# Altium project DC_Motor_Drive.PrjPcb
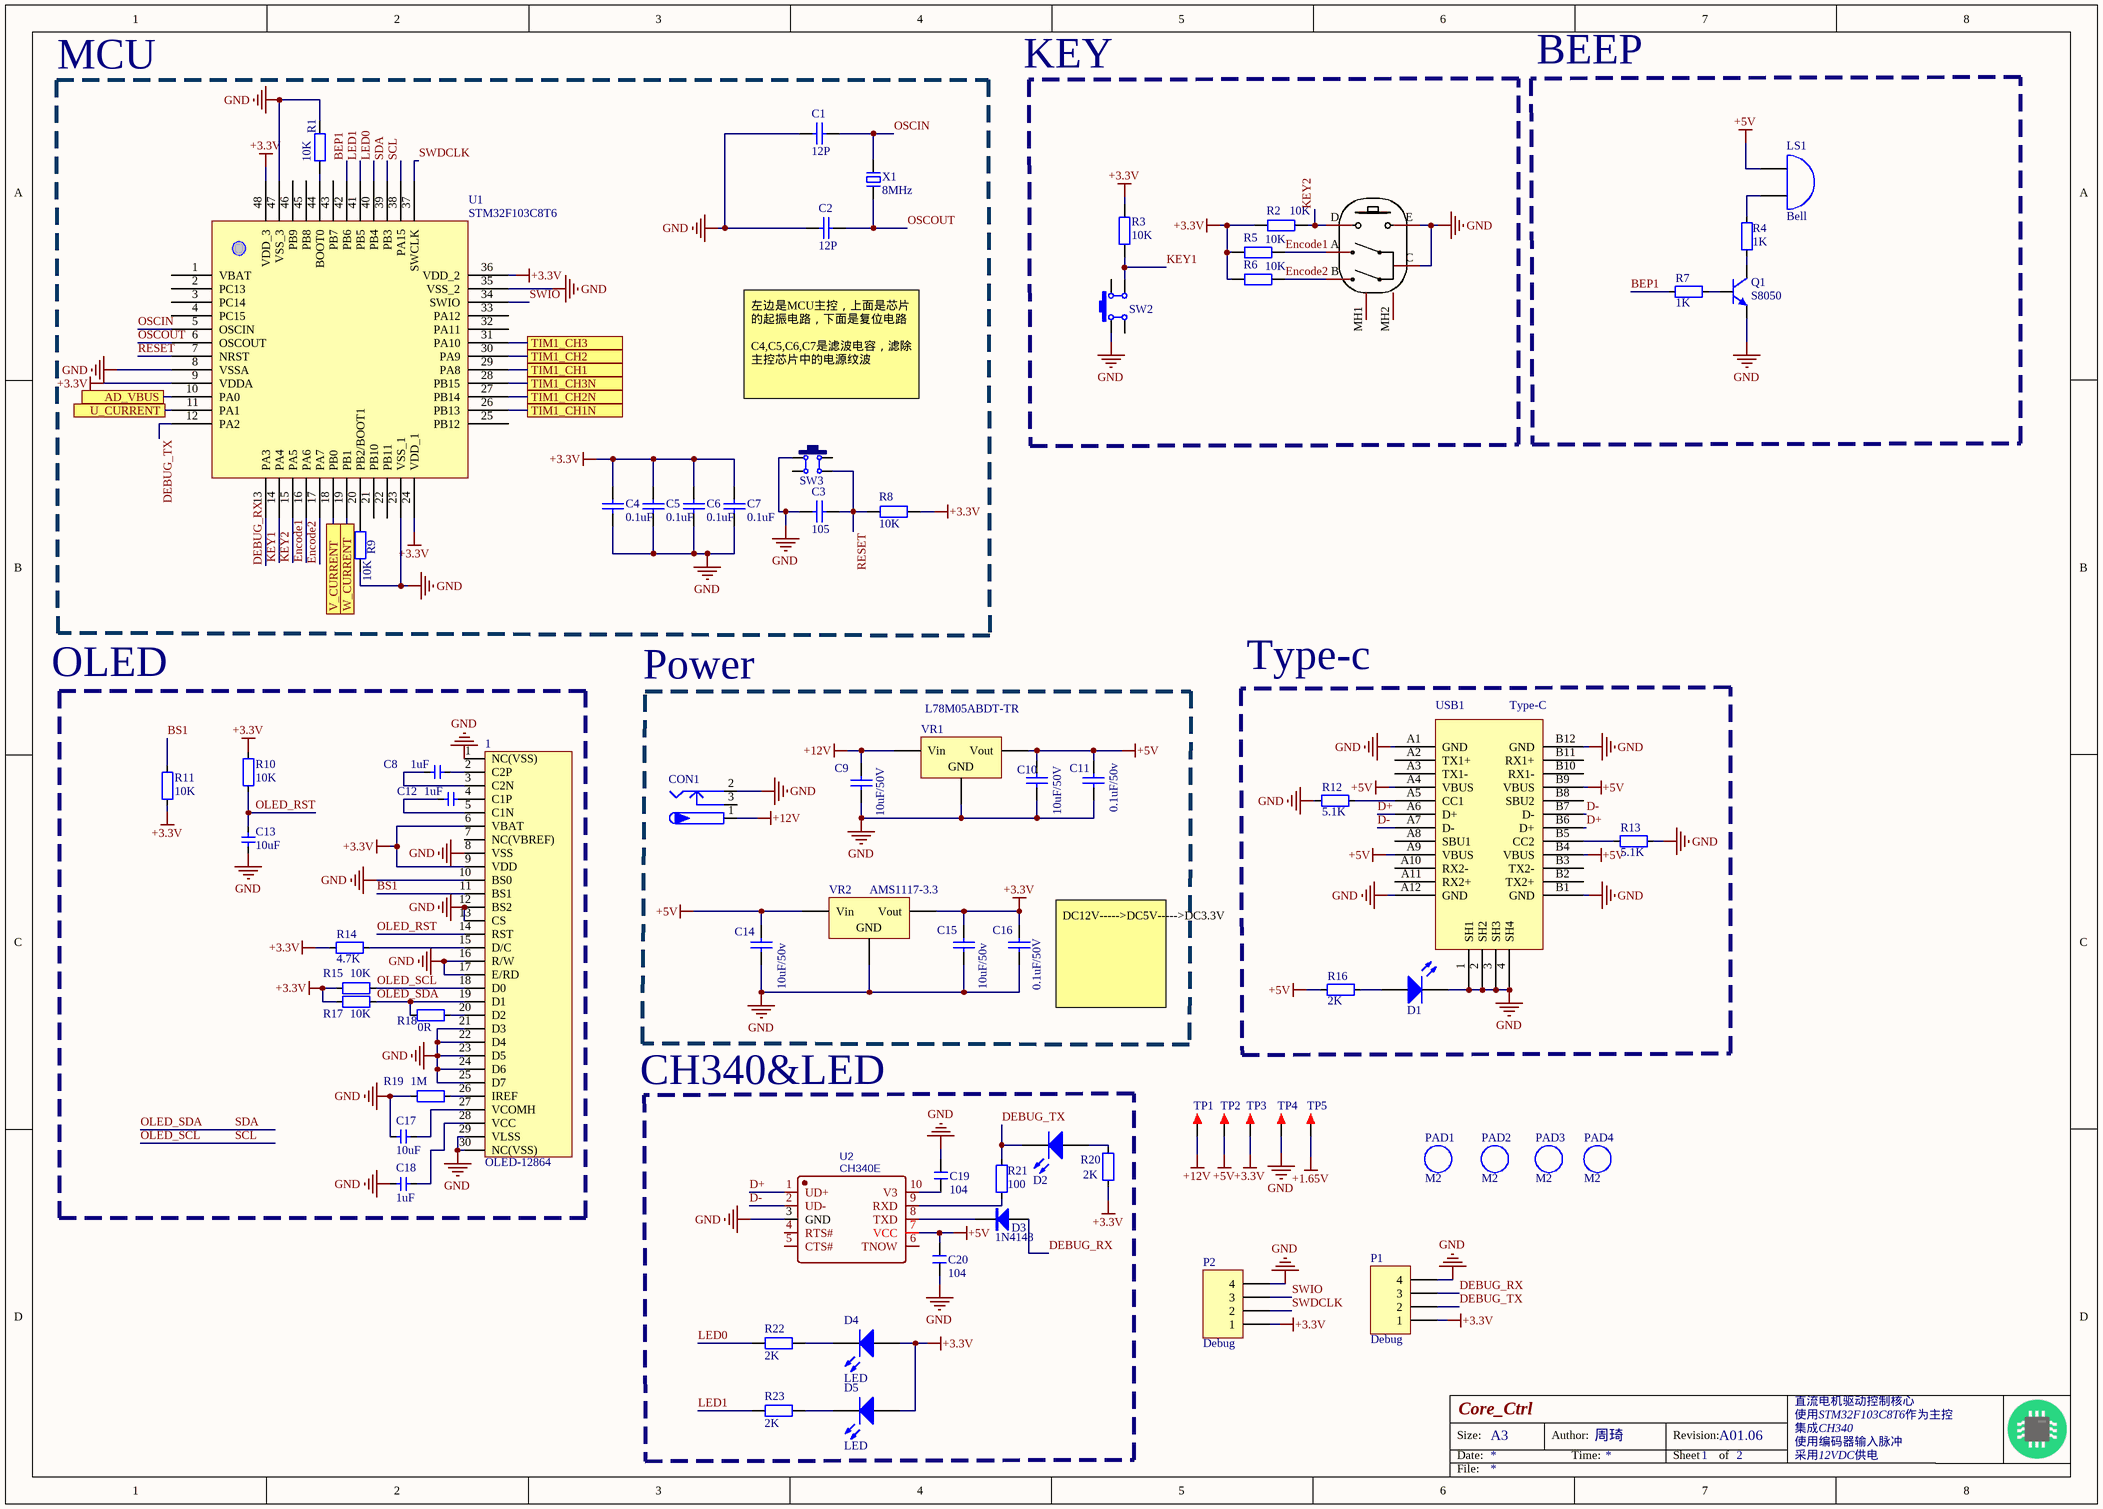
[diagram p0: Main.SchDoc]
2 sheets, 169 parts. Net scope: flat (ports and power ports of the same name join across sheets).
Board file: DC_Motor.PcbDoc
Sheets:
  Main.SchDoc
  BLDC.SchDoc

## Sheet Main.SchDoc: Core_Ctrl
size A3; Author: 周琦; Organization: 直流电机驱动控制核心; Address1: 使用STM32F103C8T6作为主控; Address2: 集成CH340; Address3: 使用编码器输入脉冲; Address4: 采用12VDC供电; Revision: A01.06; SheetNumber: 1; SheetTotal: 2

### Parts
1  OLED-12864  [OLED-12864-1.3-TOP]
C1  12P  [C0603_L]
C2  12P  [C0603_L]
C3  105  [C0603_L]
C4  0.1uF  [C0603_L]
C5  0.1uF  [C0603_L]
C6  0.1uF  [C0603_L]
C7  0.1uF  [C0603_L]
C8  1uF  [C0603_L]
C9  10uF/50V  [C1206_L]
C10  10uF/50V  [C1206_L]
C11  0.1uF/50v  [C1206_L]
C12  1uF  [C0603_L]
C13  10uF  [C0603_L]
C14  10uF/50v  [C1206_L]
C15  10uF/50v  [C1206_L]
C16  0.1uF/50V  [C0603_L]
C17  10uF  [C0603_L]
C18  1uF  [C0603_L]
C19  104  [C0603_L]
C20  104  [C0603_L]
CON1  3.5*1.3  [DC-005]  (value not drawn)
D1  LED0  [LED0603_R]  (value not drawn)
D2  LED0  [LED0603_G]  (value not drawn)
D3  1N4148  [SOD-123]
D4  LED  [LED0603_B]
D5  LED  [LED0603_B]
LS1  Bell  [BEEP 5x9x5.5]
P1  Debug  [HDR2.54-LI-4P]
P2  Debug  [HDR2.54-LI-4P]
PAD1  M2  [M2]
PAD2  M2  [M2]
PAD3  M2  [M2]
PAD4  M2  [M2]
Q1  S8050  [SOT23-3N]
R1  10K  [R0603_L]
R2  10K  [R0603_L]
R3  10K  [R0603_L]
R4  1K  [R0603_L]
R5  10K  [R0603_L]
R6  10K  [R0603_L]
R7  1K  [R0603_L]
R8  10K  [R0603_L]
R9  10K  [R0603_L]
R10  10K  [R0603_L]
R11  10K  [R0603_L]
R12  5.1K  [R0603_L]
R13  5.1K  [R0603_L]
R14  4.7K  [R0603_L]
R15  10K  [R0603_L]
R16  2K  [R0603_L]
R17  10K  [R0603_L]
R18  0R  [R0603_L]
R19  1M  [R0603_L]
R20  2K  [R0603_L]
R21  100  [R0603_L]
R22  2K  [R0603_L]
R23  2K  [R0603_L]
SW1  EC11K1524406  [SW-TH_EC11K1524406]  (value not drawn)
SW2  12x12x5  [SW DIP-12*12*4.3]  (value not drawn)
SW3  6x6x5  [SW SMD-6*6*5]  (value not drawn)
TP1  TEST  [TEST 1.6]  (value not drawn)
TP2  TEST  [TEST 1.6]  (value not drawn)
TP3  TEST  [TEST 1.6]  (value not drawn)
TP4  TEST  [TEST 1.6]  (value not drawn)
TP5  TEST  [TEST 1.6]  (value not drawn)
U1  STM32F103C8T6  [LQFP48-7*7]
U2  CH340E  [MSOP10_M]
USB1  Type-C  [USB-C-SMD_16P]
VR1  L78M05ABDT-TR  [TO-252]
VR2  AMS1117-3.3  [SOT223_L]
X1  8MHz  [OSC HC-49SMD]

### Blocks framed on the sheet
MCU: C1-C7 R1 R8 R9 SW3 U1 X1
BEEP: LS1 Q1 R4 R7
Power: C9-C11 C14-C16 CON1 VR1 VR2
Type-c: D1 R12 R13 R16 USB1

### Ports
AD_VBUS, TIM1_CH1, TIM1_CH1N, TIM1_CH2, TIM1_CH2N, TIM1_CH3, TIM1_CH3N, U_CURRENT, V_CURRENT, W_CURRENT

### Nets
+1.65V: TP5.1
+3.3V: 1.6(VBAT) 1.9(VDD) C4.1 C5.1 C6.1 C7.1 C15.2 C16.2 D4.1(A) D5.1(A) P1.1 P2.1 R2.2 R3.2 R5.2 R6.2 R8.2 R10.2 R11.1 R14.2 R15.1 R17.1 R20.1 TP3.1 U1.9(VDDA) U1.24(VDD_1) U1.36(VDD_2) U1.48(VDD_3) VR2.2(Vout)
+5V: C10.2 C11.2 C14.2 C20.1 LS1.1(A) R16.1 TP2.1 U2.7(VCC) USB1.A4(VBUS) USB1.A9(VBUS) USB1.B4(VBUS) USB1.B9(VBUS) VR1.3(Vout) VR2.3(Vin)
+12V: C9.2 CON1.1 TP1.1 VR1.1(Vin)
GND: 1.1(NC(VSS)) 1.8(VSS) 1.10(BS0) 1.12(BS2) 1.13(CS) 1.16(R/W) 1.17(E/RD) 1.21(D3) 1.22(D4) 1.23(D5) 1.24(D6) 1.25(D7) 1.29(VLSS) 1.30(NC(VSS)) C1.1 C2.1 C3.1 C4.2 C5.2 C6.2 C7.2 C9.1 C10.1 C11.1 C13.1 C14.1 C15.1 C16.1 C17.2 C18.2 C19.1 C20.2 CON1.2 D1.2(K) P1.4 P2.4 Q1.2(E) R1.2 R9.1 R12.1 R13.1 R19.1 SW1.C SW1.E SW2.1 SW3.1 TP4.1 U1.8(VSSA) U1.23(VSS_1) U1.35(VSS_2) U1.47(VSS_3) U2.3(GND) USB1.1(SH1) USB1.2(SH2) USB1.3(SH3) USB1.4(SH4) USB1.A1(GND) USB1.A12(GND) USB1.B1(GND) USB1.B12(GND) VR1.2(GND) VR2.1(GND)
BEP1: R7.1 U1.42(PB6)
BS1: 1.11(BS1) R11.2
D+: U2.1(UD+) USB1.A6(D+) USB1.B6(D+)
D-: U2.2(UD-) USB1.A7(D-) USB1.B7(D-)
DEBUG_RX: D3.1(A) P1.3 U1.13(PA3)
DEBUG_TX: D2.2(K) P1.2 R21.1 U1.12(PA2)
Encode1: R5.1 SW1.A U1.16(PA6)
Encode2: R6.1 SW1.B U1.17(PA7)
KEY1: R3.1 SW2.3 U1.14(PA4)
KEY2: R2.1 SW1.D U1.15(PA5)
LED0: R22.2 U1.40(PB4)
LED1: R23.2 U1.41(PB5)
OLED_RST: 1.14(RST) C13.2 R10.1
OLED_SCL: 1.18(D0) R15.2 U1.38(PA15)  [also labelled SCL]
OLED_SDA: 1.19(D1) R17.2 R18.2 U1.39(PB3)  [also labelled SDA]
OSCIN: C1.2 U1.5(OSCIN) X1.2
OSCOUT: C2.2 U1.6(OSCOUT) X1.1
RESET: C3.2 R8.1 SW3.3 U1.7(NRST)
SWDCLK: P2.2 U1.37(SWCLK)
SWIO: P2.3 U1.34(SWIO)
Net1_2: 1.2(C2P) C8.1
Net1_3: 1.3(C2N) C8.2
Net1_4: 1.4(C1P) C12.1
Net1_5: 1.5(C1N) C12.2
Net1_15: 1.15(D/C) R14.1
Net1_20: 1.20(D2) R18.1
Net1_26: 1.26(IREF) R19.2
Net1_27: 1.27(VCOMH) C17.1
Net1_28: 1.28(VCC) C18.1
NetC19_2: C19.2 U2.10(V3)
NetC33_2: U1.10(PA0) ; port AD_VBUS
NetC41_2: U1.19(PB1) ; port W_CURRENT
NetC44_2: U1.11(PA1) ; port U_CURRENT
NetC45_2: U1.18(PB0) ; port V_CURRENT
NetD1_1: D1.1(A) R16.2
NetD2_1: D2.1(A) R20.2
NetD3_2: D3.2(K) U2.8(TXD)
NetD4_2: D4.2(K) R22.1
NetD5_2: D5.2(K) R23.1
NetLS1_2: LS1.2(B) R4.2
NetQ1_1: Q1.1(B) R7.2
NetQ1_3: Q1.3(C) R4.1
NetR1_1: R1.1 U1.44(BOOT0)
NetR9_2: R9.2 U1.20(PB2/BOOT1)
NetR12_2: R12.2 USB1.A5(CC1)
NetR13_2: R13.2 USB1.B5(CC2)
NetR21_2: R21.2 U2.9(RXD)
NetR28_1: U1.29(PA8) ; port TIM1_CH1
NetR32_1: U1.26(PB13) ; port TIM1_CH1N
NetR46_1: U1.30(PA9) ; port TIM1_CH2
NetR47_1: U1.27(PB14) ; port TIM1_CH2N
NetR58_1: U1.31(PA10) ; port TIM1_CH3
NetR60_1: U1.28(PB15) ; port TIM1_CH3N

Not connected (* = marked no-connect by the designer): 1 7(NC(VBREF)); CON1 3; SW1 MH1 MH2; SW2 2 4; SW3 2 4; U1 1(VBAT) 2(PC13) 3(PC14) 4(PC15) 21(PB10) 22(PB11) 25(PB12) 32(PA11) 33(PA12) 43(PB7) 45(PB8) 46(PB9); U2 4(RTS#) 5(CTS#) 6(TNOW); USB1 A2(TX1+) A3(TX1-) A8(SBU1) A10(RX2-) A11(RX2+) B2(TX2+) B3(TX2-) B8(SBU2) B10(RX1-) B11(RX1+)

### Notes on the sheet
- KEY
- 左边是MCU主控，上面是芯片的起振电路，下面是复位电路
  C4,C5,C6,C7是滤波电容，滤除主控芯片中的电源纹波
- OLED
- (near C16) DC12V----->DC5V----->DC3.3V
- CH340&LED
- Size:
- Date:
- A3
- Author:
- Time:
- Revision:
- Sheet
- of
- File:

### Library data of the parts
1 = OLED-12864: 显示屏
C1-C7 = C: 贴片电容; BOM名称: 无极性贴片电容; 联系卖家，免费查找封装: 唯一出售店铺网址https://shop463601444.taobao.com
C8 C12 C13 C17 C18 = 电容-0402: Capacitor; Value: 0.1u
C9 C10 C16 = Cap: C89632; LC: C1591; parm: 100V
C11 = Cap
C14 C15 = Cap: LC: C1591
C19 C20 = C: 无极性贴片电容; 版权归属: 源创客; BOM名称: 无极性贴片电容; 学习资源: www.ooocke.com
CON1 = P-DC: 低压电源接口; BOM名称: DC电源接口; 联系卖家，免费技术支持: 唯一出售店铺网址https://shop463601444.taobao.com
D1 D2 = LED0: 发光二极管; Published: 8-Jun-2000; LatestRevisionDate: 08-Jul-2005; LatestRevisionNote: Mech Layer 1 removed.; PackageReference: LED-0; Publisher: Altium Limited
D3 = M7: 整流二极管; 版权归属: 源创客; BOM名称: 整流二极管; 学习资源: www.ooocke.com
D4 D5 = LED: 发光二极管; 封装库来自淘宝卖家 ID：黄晶宝石: 其他店铺购入均为假冒，请立即申请退款，本店奖励现金5~20元
LS1 = Bell: Electrical Bell; Published: 24-Mar-1999; LatestRevisionDate: 17-Jul-2002; LatestRevisionNote: Re-released for DXP Platform.; PackageReference: PIN2; Publisher: Altium Limited
P1 P2 = Header 4: Header, 4-Pin; LatestRevisionDate: 17-Jul-2002; LatestRevisionNote: Re-released for DXP Platform.; Publisher: Altium Limited
PAD1-PAD4 = M3: 铜柱孔; 联系卖家，免费查找封装: 唯一出售店铺网址https://shop463601444.taobao.com; BOM名称: 铜柱孔
Q1 = 8050-SMD: 高频放大-NPN型; 联系卖家，免费查找封装: 唯一出售店铺网址https://shop463601444.taobao.com; 封装库来自淘宝卖家 ID：黄晶宝石: 其他店铺购入均为盗版，不享受售后技术支持服务，请立即申请退款; 参数: 40V 1.5A 1W 100MHZ; BOM名称: 高频放大-NPN型
R1-R3 R5 R6 R8 R9 R22 R23 = R: 贴片电阻; 联系卖家，免费查找封装: 唯一出售店铺网址https://shop463601444.taobao.com; 封装库来自淘宝卖家ID：黄晶宝石: 其他店铺购入均为盗版假冒封装库，请立即申请退款; BOM名称: 贴片电阻
R4 R7 R10-R21 = 电阻-0402: Resistor; Value: 22R
SW1 = EC11K1524406: Manufacturer: ALPSALPINE(阿尔卑斯阿尔派); Add into BOM: yes; Name: EC11K1524406; Symbol: EC11K1524406; Device: EC11K1524406; LCSC Part Name: 编码器; Supplier Part: C398934; Manufacturer Part: EC11K1524406; Supplier Footprint: 插件; JLCPCB Part Class: Extended Part; Datasheet: https://atta.szlcsc.com/upload/public/pdf/source/20190620/C398934_DDD5BF6D843226194F24C74B1929B82F.pdf; Supplier: LCSC; Convert to PCB: yes
SW2 = TSW DIP-12x12: 直插12x12轻触开关; 联系卖家，免费查找封装: 唯一出售店铺网址https://shop463601444.taobao.com; BOM名称: 直插12x12轻触开关
SW3 = TSW SMD-6x6: 贴片6x6轻触开关; 版权归属: 源创客; BOM名称: 贴片6x6轻触开关; 学习资源: www.ooocke.com
TP1-TP5 = TEST: 测试点; 联系卖家，免费查找封装: 唯一出售店铺网址https://shop463601444.taobao.com; BOM名称: 测试点
U2 = CH340E: BOM_Manufacturer: WCH; subpart_no: 1; BOM_Supplier: LCSC; BOM_Manufacturer Part: CH340E; BOM_Supplier Part: C99652; BOM_JLCPCB Part Class: Extended Part; spicePre: U; spiceSymbolName: CH340E
USB1 = USB-Type-C-TOP
VR1 = TO-252-2 L78M05ABDT-TR: 低压差线性稳压(LDO); ComponentLink1Description: 供应商链接; ComponentLink1URL: http://www.szlcsc.com/product/details_59107.html; Package: TO-252-2; Supplier: LC; SuppliersPartNumber: C58069
VR2 = SOT-223 AMS1117-3.3: 低压差线性稳压(LDO); ComponentLink1Description: 供应商链接; ComponentLink1URL: http://www.szlcsc.com/product/details_6652.html; Package: SOT-223; Supplier: LC; SuppliersPartNumber: C6186
X1 = XTAL-2P: 2脚无源脚晶振; 联系卖家，免费查找封装: 唯一出售店铺网址https://shop463601444.taobao.com; BOM名称: 2脚无源脚晶振

## Sheet BLDC.SchDoc: BLDC电机驱动
size A3; Author: 周琦; Organization: 模块：电机驱动; Address1: 使用栅极驱动芯片，自带闭锁功能; Address2: 内建死区控制电路; Address3: 使用N-MOS驱动电机; Address4: 适用与三相直流无刷电机; Revision: A01.06; SheetNumber: 2; SheetTotal: 2
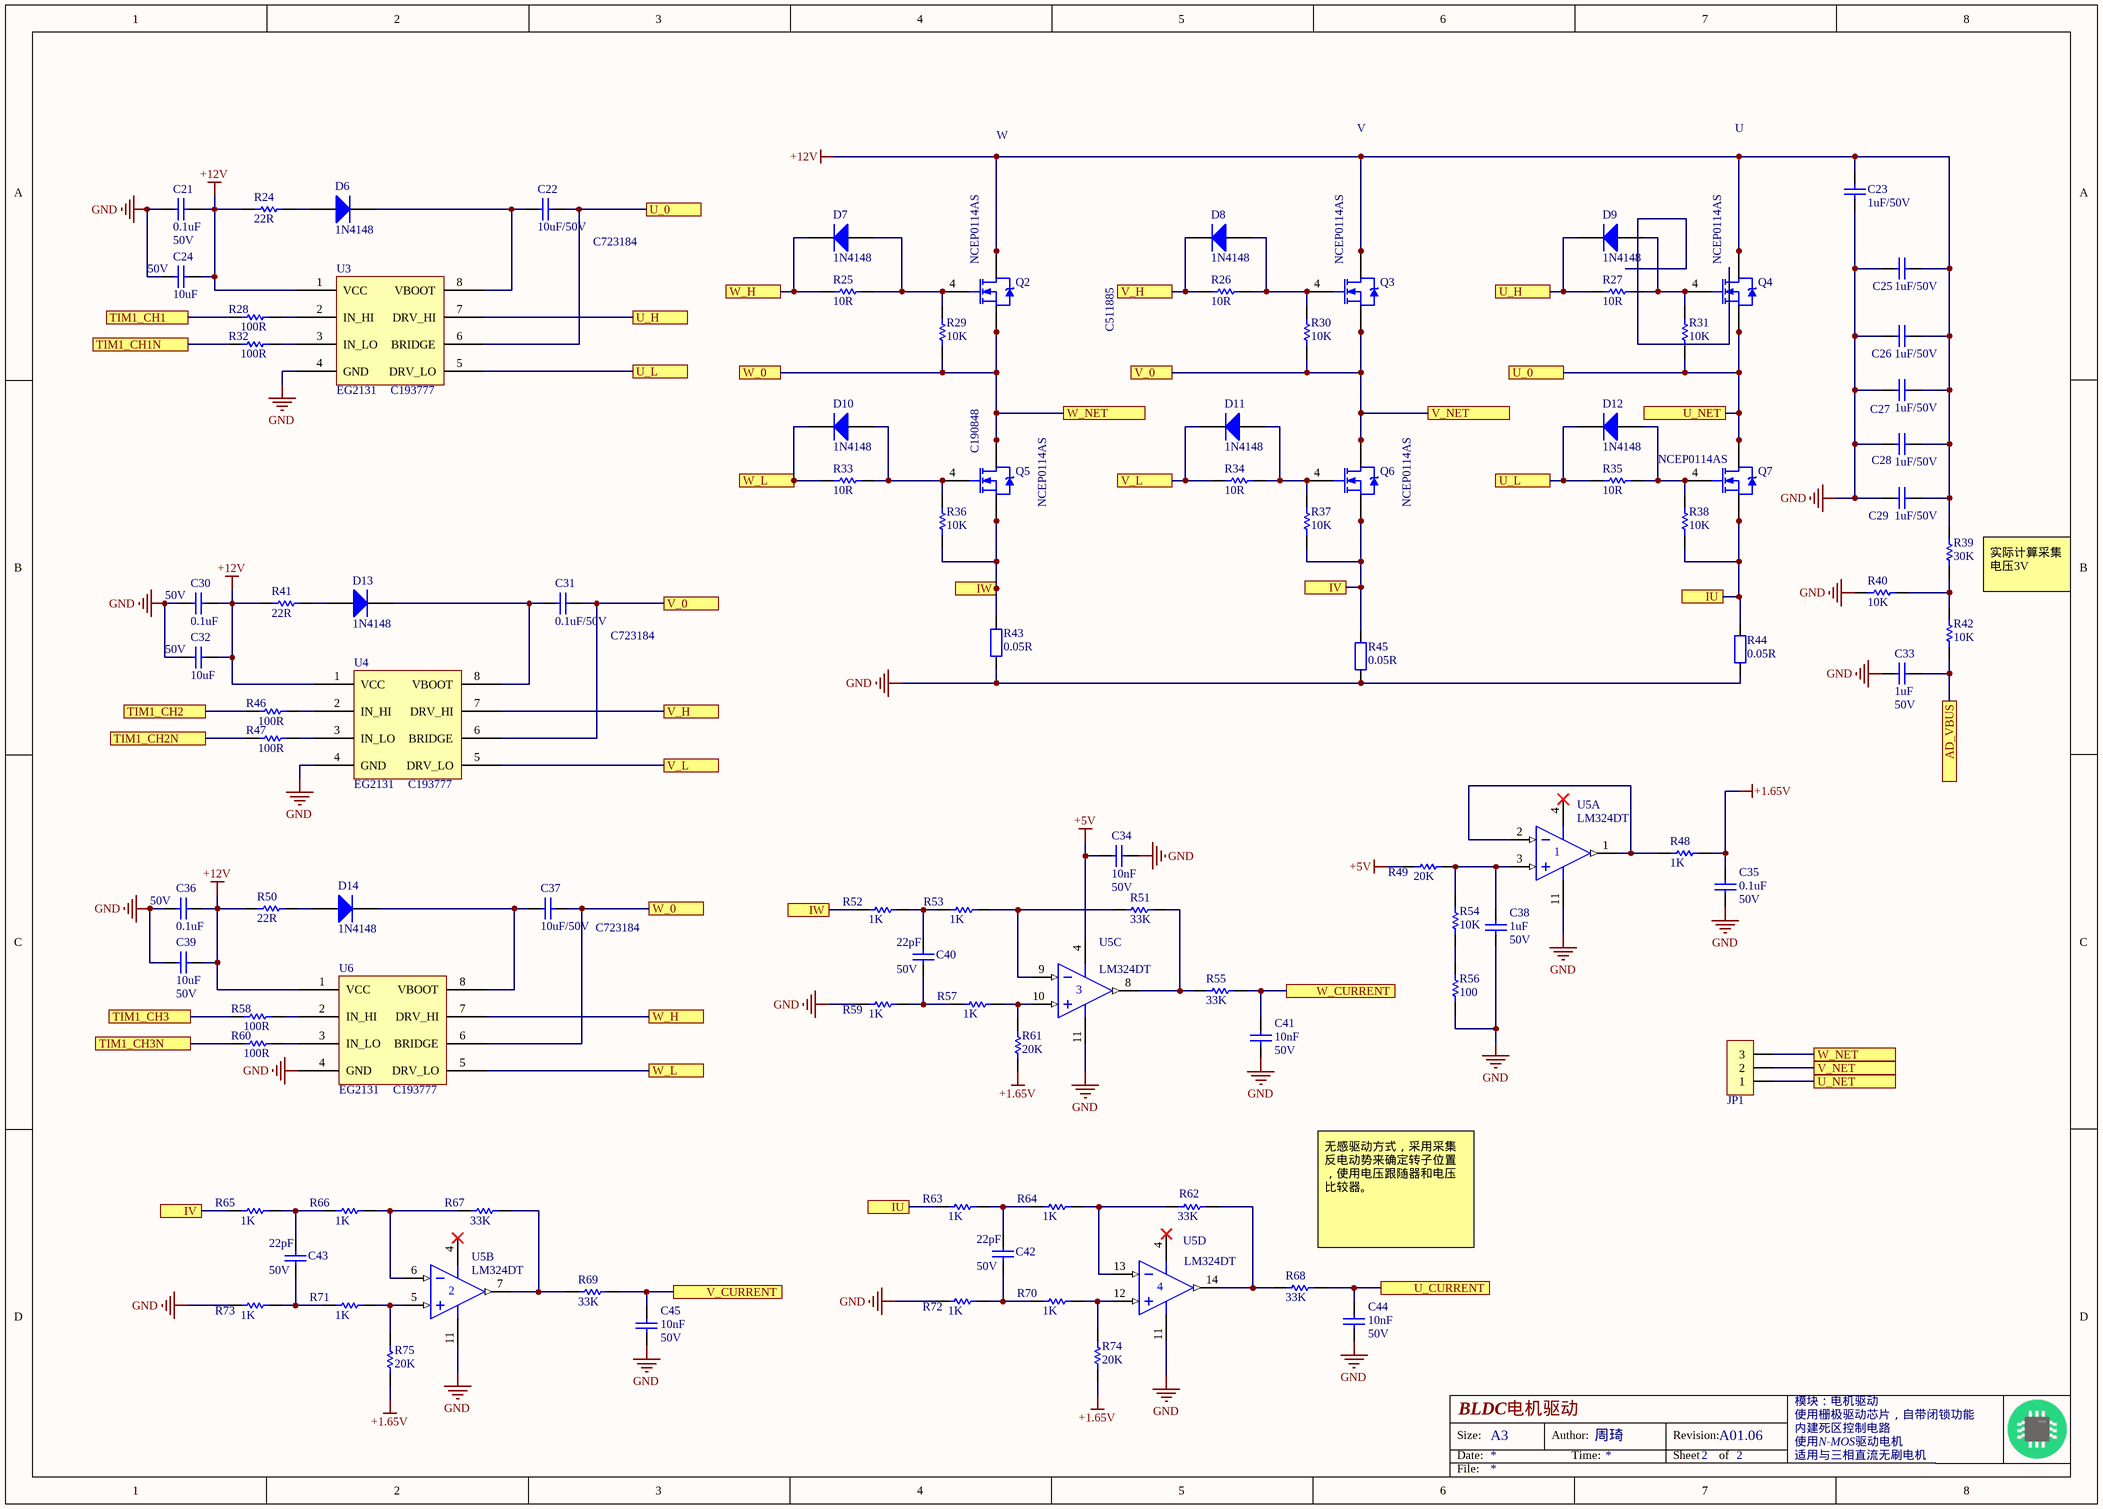
[diagram p1: BLDC.SchDoc]

### Parts
C21  0.1uF  parm: 50V  [C0603_L]
C22  10uF/50V  [C0603_L]
C23  1uF/50V  [C1210_L]
C24  10uF  parm: 50V  [C0805_L]
C25  1uF/50V  [C1210_L]
C26  1uF/50V  [C1210_L]
C27  1uF/50V  [C1210_L]
C28  1uF/50V  [C1210_L]
C29  1uF/50V  [C1210_L]
C30  0.1uF  parm: 50V  [C0603_L]
C31  0.1uF/50V  [C0603_L]
C32  10uF  parm: 50V  [C0805_L]
C33  1uF  parm: 50V  [C0603_L]
C34  10nF  parm: 50V  [C0603_L]
C35  0.1uF  parm: 50V  [C0603_L]
C36  0.1uF  parm: 50V  [C0603_L]
C37  10uF/50V  [C0603_L]
C38  1uF  parm: 50V  [C0603_L]
C39  10uF  parm: 50V  [C0805_L]
C40  22pF  parm: 50V  [C0603_L]
C41  10nF  parm: 50V  [C0603_L]
C42  22pF  parm: 50V  [C0603_L]
C43  22pF  parm: 50V  [C0603_L]
C44  10nF  parm: 50V  [C0603_L]
C45  10nF  parm: 50V  [C0603_L]
D6  1N4148  [SOD-123]
D7  1N4148  [SOD-123]
D8  1N4148  [SOD-123]
D9  1N4148  [SOD-123]
D10  1N4148  [SOD-123]
D11  1N4148  [SOD-123]
D12  1N4148  [SOD-123]
D13  1N4148  [SOD-123]
D14  1N4148  [SOD-123]
JP1  HDR-1X3  [KF350-3P]  (value not drawn)
Q2  NCEP0114AS  [SOP8]
Q3  NCEP0114AS  [SOP8]
Q4  NCEP0114AS  [SOP8]
Q5  NCEP0114AS  [SOP8]
Q6  NCEP0114AS  [SOP8]
Q7  NCEP0114AS  [SOP8]
R24  22R  [R0603_L]
R25  10R  [R0603_L]
R26  10R  [R0603_L]
R27  10R  [R0603_L]
R28  100R  [R0603_L]
R29  10K  [R0603_L]
R30  10K  [R0603_L]
R31  10K  [R0603_L]
R32  100R  [R0603_L]
R33  10R  [R0603_L]
R34  10R  [R0603_L]
R35  10R  [R0603_L]
R36  10K  [R0603_L]
R37  10K  [R0603_L]
R38  10K  [R0603_L]
R39  30K  [R0603_L]
R40  10K  [R0603_L]
R41  22R  [R0603_L]
R42  10K  [R0603_L]
R43  0.05R  [R2512_L]
R44  0.05R  [R2512_L]
R45  0.05R  [R2512_L]
R46  100R  [R0603_L]
R47  100R  [R0603_L]
R48  1K  [R0603_L]
R49  20K  [R0603_L]
R50  22R  [R0603_L]
R51  33K  [R0603_L]
R52  1K  [R0603_L]
R53  1K  [R0603_L]
R54  10K  [R0603_L]
R55  33K  [R0603_L]
R56  100  [R0603_L]
R57  1K  [R0603_L]
R58  100R  [R0603_L]
R59  1K  [R0603_L]
R60  100R  [R0603_L]
R61  20K  [R0603_L]
R62  33K  [R0603_L]
R63  1K  [R0603_L]
R64  1K  [R0603_L]
R65  1K  [R0603_L]
R66  1K  [R0603_L]
R67  33K  [R0603_L]
R68  33K  [R0603_L]
R69  33K  [R0603_L]
R70  1K  [R0603_L]
R71  1K  [R0603_L]
R72  1K  [R0603_L]
R73  1K  [R0603_L]
R74  20K  [R0603_L]
R75  20K  [R0603_L]
U3  EG2131  [SOP8]
U4  EG2131  [SOP8]
U5  LM324DT  [SOIC-14]  (parts A,B,C,D of 4)
U6  EG2131  [SOP8]

### Ports
AD_VBUS, IU, IV, IW, TIM1_CH1, TIM1_CH1N, TIM1_CH2, TIM1_CH2N, TIM1_CH3, TIM1_CH3N, U_0, U_CURRENT, U_H, U_L, U_NET, V_0, V_CURRENT, V_H, V_L, V_NET, W_0, W_CURRENT, W_H, W_L, W_NET

### Nets
+1.65V: C35.2 R48.1 R61.1 R74.1 R75.1
+5V: C34.2 R49.1 U5.4(V+)
+12V: C21.1 C23.1 C24.1 C25.1 C26.1 C27.1 C28.1 C29.1 C30.1 C32.1 C36.1 C39.1 Q2.5(D) Q2.6(D) Q2.7(D) Q2.8(D) Q3.5(D) Q3.6(D) Q3.7(D) Q3.8(D) Q4.5(D) Q4.6(D) Q4.7(D) Q4.8(D) R24.1 R39.2 R41.1 R50.1 U3.1(VCC) U4.1(VCC) U6.1(VCC)
GND: C21.2 C23.2 C24.2 C25.2 C26.2 C27.2 C28.2 C29.2 C30.2 C32.2 C33.1 C34.1 C35.1 C36.2 C38.1 C39.2 C41.1 C44.1 C45.1 R40.2 R43.1 R44.1 R45.1 R56.1 R59.1 R72.1 R73.1 U3.4(GND) U4.4(GND) U5.11(V-) U6.4(GND)
NetC22_1: C22.1 JP1.1 Q4.1(S) Q4.2(S) Q4.3(S) Q7.5(D) Q7.6(D) Q7.7(D) Q7.8(D) R31.1 U3.6(BRIDGE) ; port U_0, port U_NET
NetC22_2: C22.2 D6.2(K) U3.8(VBOOT)
NetC31_1: C31.1 JP1.2 Q3.1(S) Q3.2(S) Q3.3(S) Q6.5(D) Q6.6(D) Q6.7(D) Q6.8(D) R30.1 U4.6(BRIDGE) ; port V_0, port V_NET
NetC31_2: C31.2 D13.2(K) U4.8(VBOOT)
NetC33_2: C33.2 R42.2 ; port AD_VBUS
NetC37_1: C37.1 JP1.3 Q2.1(S) Q2.2(S) Q2.3(S) Q5.5(D) Q5.6(D) Q5.7(D) Q5.8(D) R29.1 U6.6(BRIDGE) ; port W_0, port W_NET
NetC37_2: C37.2 D14.2(K) U6.8(VBOOT)
NetC38_2: C38.2 R49.2 R54.2 U5.3(IN+)
NetC40_1: C40.1 R52.2 R53.1
NetC40_2: C40.2 R57.1 R59.2
NetC41_2: C41.2 R55.1 ; port W_CURRENT
NetC42_1: C42.1 R63.2 R64.1
NetC42_2: C42.2 R70.1 R72.2
NetC43_1: C43.1 R65.2 R66.1
NetC43_2: C43.2 R71.1 R73.2
NetC44_2: C44.2 R68.1 ; port U_CURRENT
NetC45_2: C45.2 R69.1 ; port V_CURRENT
NetD6_1: D6.1(A) R24.2
NetD7_1: D7.1(A) Q2.4(G) R25.2 R29.2
NetD7_2: D7.2(K) R25.1 U6.7(DRV_HI) ; port W_H
NetD8_1: D8.1(A) Q3.4(G) R26.2 R30.2
NetD8_2: D8.2(K) R26.1 U4.7(DRV_HI) ; port V_H
NetD9_1: D9.1(A) Q4.4(G) R27.2 R31.2
NetD9_2: D9.2(K) R27.1 U3.7(DRV_HI) ; port U_H
NetD10_1: D10.1(A) Q5.4(G) R33.2 R36.2
NetD10_2: D10.2(K) R33.1 U6.5(DRV_LO) ; port W_L
NetD11_1: D11.1(A) Q6.4(G) R34.2 R37.2
NetD11_2: D11.2(K) R34.1 U4.5(DRV_LO) ; port V_L
NetD12_1: D12.1(A) Q7.4(G) R35.2 R38.2
NetD12_2: D12.2(K) R35.1 U3.5(DRV_LO) ; port U_L
NetD13_1: D13.1(A) R41.2
NetD14_1: D14.1(A) R50.2
NetQ5_1: Q5.1(S) Q5.2(S) Q5.3(S) R36.1 R43.2 R52.1 ; port IW
NetQ6_1: Q6.1(S) Q6.2(S) Q6.3(S) R37.1 R45.2 R65.1 ; port IV
NetQ7_1: Q7.1(S) Q7.2(S) Q7.3(S) R38.1 R44.2 R63.1 ; port IU
NetR28_1: R28.1 ; port TIM1_CH1
NetR28_2: R28.2 U3.2(IN_HI)
NetR32_1: R32.1 ; port TIM1_CH1N
NetR32_2: R32.2 U3.3(IN_LO)
NetR39_1: R39.1 R40.1 R42.1
NetR46_1: R46.1 ; port TIM1_CH2
NetR46_2: R46.2 U4.2(IN_HI)
NetR47_1: R47.1 ; port TIM1_CH2N
NetR47_2: R47.2 U4.3(IN_LO)
NetR48_2: R48.2 U5.1(OUT) U5.2(IN-)
NetR51_1: R51.1 R53.2 U5.9(IN-)
NetR51_2: R51.2 R55.2 U5.8(OUT)
NetR54_1: R54.1 R56.2
NetR57_2: R57.2 R61.2 U5.10(IN+)
NetR58_1: R58.1 ; port TIM1_CH3
NetR58_2: R58.2 U6.2(IN_HI)
NetR60_1: R60.1 ; port TIM1_CH3N
NetR60_2: R60.2 U6.3(IN_LO)
NetR62_1: R62.1 R64.2 U5.13(IN-)
NetR62_2: R62.2 R68.2 U5.14(OUT)
NetR66_2: R66.2 R67.1 U5.6(IN-)
NetR67_2: R67.2 R69.2 U5.7(OUT)
NetR70_2: R70.2 R74.2 U5.12(IN+)
NetR71_2: R71.2 R75.2 U5.5(IN+)

### Notes on the sheet
- W
- V
- U
- (near C22) C723184
- C511885
- (near Q5) C190848
- 实际计算采集电压3V
- (near C31) C723184
- (near C37) C723184
- (near R68) 无感驱动方式，采用采集反电动势来确定转子位置，使用电压跟随器和电压比较器。
- Size:
- Date:
- A3
- Author:
- Time:
- Revision:
- Sheet
- of
- File:

### Library data of the parts
C21 C23-C30 C32-C36 C38-C45 = Cap: LC: C1591
C22 C31 C37 = Cap: C89632; LC: C1591; parm: 100V
D6-D14 = SOD-323 1N4148WS T4: 二极管; ComponentLink1Description: 供应商链接; ComponentLink1URL: http://www.szlcsc.com/product/details_2485.html; Package: SOD-323; Supplier: LC; SuppliersPartNumber: C2128
JP1 = Header 3: 3P接插件; 版权归属: 源创客; BOM名称: 3P接插件; 学习资源: www.ooocke.com
Q2-Q7 = NMOS-2: C190848; Note: Pin 2 is electrically connected to pin 4.; Published: 8-Jun-2000; LatestRevisionDate: 17-Jul-2002; LatestRevisionNote: Re-released for DXP Platform.; DatasheetDocument: PD-9.814; PackageReference: TO-220AB; Publisher: 60V; Code_JEDEC: TO-220-AB; ComponentLink1Description: Manufacturer Link; ComponentLink1URL: http://www.irf.com/
R24-R42 R46-R75 = Res1: Resistor; LC: *
R43-R45 = R-I: 电流检测电阻; 版权归属: 源创客; BOM名称: 电流检测电阻; 学习资源: www.ooocke.com
U3 U4 U6 = NCP5106BDR2G: C193777; 编号: C193777
U5 = LM324DT_[C71035]: 运放; ComponentLink1Description: 供应商链接; ComponentLink1URL: http://www.szlcsc.com/product/details_72134.html; Package: SOIC-14_150mil; Supplier: LC; SuppliersPartNumber: C71035

## Nets that join several sheets
+1.65V: Main (TP5.1), BLDC (5 pins)
+5V: Main (14 pins), BLDC (C34.2 R49.1 U5.4)
+12V: Main (C9.2 CON1.1 TP1.1 VR1.1), BLDC (31 pins)
GND: Main (62 pins), BLDC (31 pins)
NetC33_2: Main (U1.10), BLDC (C33.2 R42.2)
NetC41_2: Main (U1.19), BLDC (C41.2 R55.1)
NetC44_2: Main (U1.11), BLDC (C44.2 R68.1)
NetC45_2: Main (U1.18), BLDC (C45.2 R69.1)
NetR28_1: Main (U1.29), BLDC (R28.1)
NetR32_1: Main (U1.26), BLDC (R32.1)
NetR46_1: Main (U1.30), BLDC (R46.1)
NetR47_1: Main (U1.27), BLDC (R47.1)
NetR58_1: Main (U1.31), BLDC (R58.1)
NetR60_1: Main (U1.28), BLDC (R60.1)